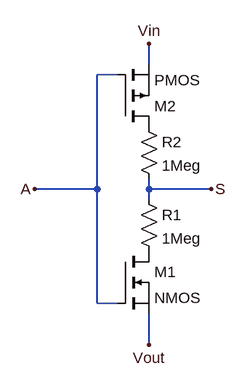
[diagram p0: schematic SNOT.asc]
SNOT.asc, the LTspice schematic file:
Version 4
SHEET 1 880 680
WIRE 496 80 496 48
WIRE 448 96 416 96
WIRE 416 272 416 96
WIRE 416 272 320 272
WIRE 496 272 496 256
WIRE 592 272 496 272
WIRE 496 288 496 272
WIRE 416 448 416 272
WIRE 448 448 416 448
WIRE 496 512 496 464
FLAG 320 272 A
FLAG 592 272 S
FLAG 496 48 Vin
FLAG 496 512 Vout
SYMBOL nmos 448 368 R0
SYMATTR InstName M1
SYMBOL res 480 272 R0
SYMATTR InstName R1
SYMATTR Value 1Meg
SYMATTR SpiceLine tol=1 pwr=0.1
SYMBOL res 480 160 R0
SYMATTR InstName R2
SYMATTR Value 1Meg
SYMATTR SpiceLine tol=1 pwr=0.1
SYMBOL pmos 448 176 M180
SYMATTR InstName M2

The netlist it stands for:
* SNOT.asc
M1 P001 A Vout Vout NMOS
R1 S P001 1Meg tol=1 pwr=0.1
R2 P002 S 1Meg tol=1 pwr=0.1
M2 P002 A Vin Vin PMOS
.model NMOS NMOS
.model PMOS PMOS
.lib standard.mos
.backanno
.end